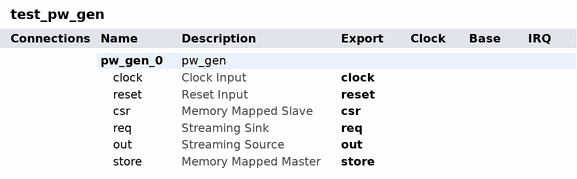
[diagram p0: system contents]
# Platform Designer (Qsys) system test_pw_gen, MAX 10 10M50DAF484C6GES
# Parameters at their usual value, and those the tool derives, are not listed.
package require qsys
create_system test_pw_gen
set_project_property DEVICE_FAMILY {MAX 10}
set_project_property DEVICE 10M50DAF484C6GES

add_instance pw_gen_0 pw_gen 1.0
set_instance_parameter_value pw_gen_0 PW1_RESET 0
set_instance_parameter_value pw_gen_0 PW2_RESET 0
set_instance_parameter_value pw_gen_0 PW3_FINAL 170
set_instance_parameter_value pw_gen_0 PW3_RESET 170

# exported interfaces
add_interface clock clock sink
set_interface_property clock EXPORT_OF pw_gen_0.clock
add_interface csr avalon slave
set_interface_property csr EXPORT_OF pw_gen_0.csr
add_interface out avalon_streaming source
set_interface_property out EXPORT_OF pw_gen_0.out
add_interface req avalon_streaming sink
set_interface_property req EXPORT_OF pw_gen_0.req
add_interface reset reset sink
set_interface_property reset EXPORT_OF pw_gen_0.reset
add_interface store avalon master
set_interface_property store EXPORT_OF pw_gen_0.store

set_interconnect_requirement {$system} qsys_mm.clockCrossingAdapter HANDSHAKE
set_interconnect_requirement {$system} qsys_mm.enableEccProtection FALSE
set_interconnect_requirement {$system} qsys_mm.insertDefaultSlave FALSE
set_interconnect_requirement {$system} qsys_mm.maxAdditionalLatency 1

save_system test_pw_gen.qsys
